# Altium schematic sheet Architecture.SchDoc: Architecture
size A4 portrait; SheetNumber: 2; SheetTotal: 2
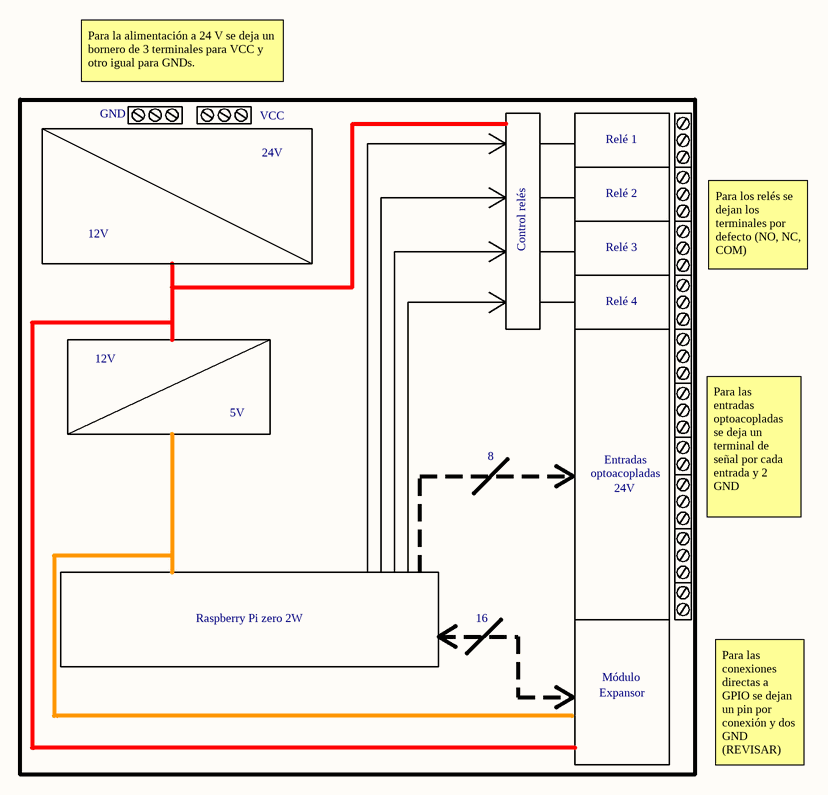
[diagram p0: Architecture.SchDoc]

## Notes on the sheet
- Para la alimentación a 24 V se deja un bornero de 3 terminales para VCC y otro igual para GNDs.
- GND
- VCC
- 24V
- Relé 1
- Relé 2
- 12V
- Control relés
- Relé 3
- Relé 4
- Para los relés se dejan los terminales por defecto (NO, NC, COM)
- 5V
- 8
- Entradas
- optoacopladas
- Para las entradas optoacopladas se deja un terminal de señal por cada entrada y 2 GND
- Raspberry Pi zero 2W
- 16
- Expansor
- Módulo
- Para las conexiones directas a GPIO se dejan un pin por conexión y dos GND (REVISAR)